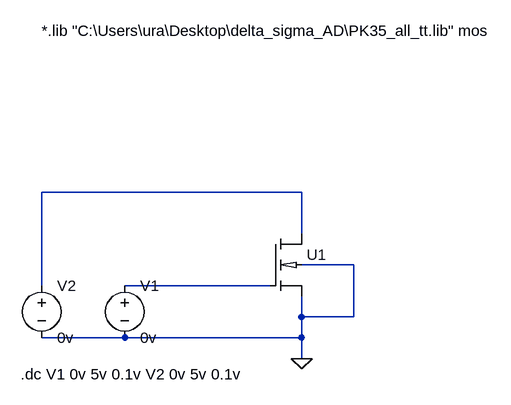
[diagram p0: schematic comp_ph.asc]
comp_ph.asc, the LTspice schematic file:
Version 4
SHEET 1 880 680
WIRE 112 96 -288 96
WIRE 112 160 112 96
WIRE 192 208 112 208
WIRE -288 240 -288 96
WIRE 64 240 -160 240
WIRE 112 288 112 256
WIRE 192 288 192 208
WIRE 192 288 112 288
WIRE -160 320 -288 320
WIRE 112 320 112 288
WIRE 112 320 -160 320
WIRE 112 352 112 320
FLAG 112 352 0
SYMBOL NMD4 64 160 R0
SYMATTR InstName U1
SYMATTR Value ""
SYMATTR SpiceModel NMD
SYMBOL voltage -160 224 R0
WINDOW 123 0 0 Left 0
WINDOW 39 0 0 Left 0
SYMATTR InstName V1
SYMATTR Value 0v
SYMBOL voltage -288 224 R0
WINDOW 123 0 0 Left 0
WINDOW 39 0 0 Left 0
SYMATTR InstName V2
SYMATTR Value 0v
TEXT -288 -152 Left 2 !*.lib "C:\\Users\\ura\\Desktop\\delta_sigma_AD\\PK35_all_tt.lib" mos
TEXT -320 376 Left 2 !.dc V1 0v 5v 0.1v V2 0v 5v 0.1v

The netlist it stands for:
* comp_ph.asc
XU1 N001 N002 0 0 NMD  ; pins D G S B
V1 N002 0 0v
V2 N001 0 0v
*.lib "C:\Users\ura\Desktop\delta_sigma_AD\PK35_all_tt.lib" mos
.dc V1 0v 5v 0.1v V2 0v 5v 0.1v
.backanno
.end